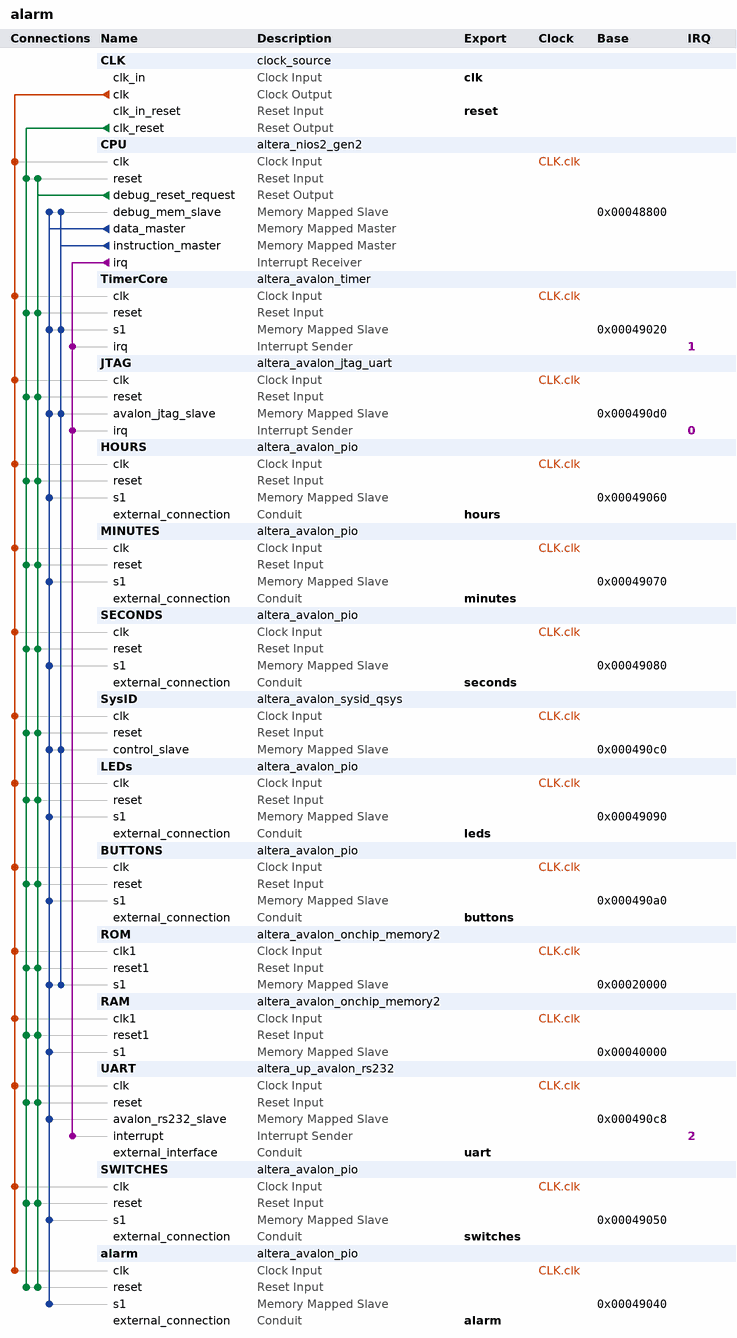
[diagram p0: system contents]
# Platform Designer (Qsys) system alarm, Cyclone V 5CSEMA5F31C6
# Parameters at their usual value, and those the tool derives, are not listed.
package require -exact qsys 18.1
create_system alarm
set_project_property DEVICE_FAMILY {Cyclone V}
set_project_property DEVICE 5CSEMA5F31C6

add_instance CLK clock_source 18.1
set_instance_parameter_value CLK clockFrequency 50000000

add_instance CPU altera_nios2_gen2 18.1
set_instance_parameter_value CPU dcache_size 2048
set_instance_parameter_value CPU exceptionSlave ROM.s1
set_instance_parameter_value CPU icache_size 4096
set_instance_parameter_value CPU impl Tiny
set_instance_parameter_value CPU resetSlave ROM.s1

add_instance TimerCore altera_avalon_timer 18.1
set_instance_parameter_value TimerCore fixedPeriod true
set_instance_parameter_value TimerCore period 1
set_instance_parameter_value TimerCore periodUnits SEC

add_instance JTAG altera_avalon_jtag_uart 18.1
set_instance_parameter_value JTAG simInteractiveOptions NO_INTERACTIVE_WINDOWS

add_instance HOURS altera_avalon_pio 18.1
set_instance_parameter_value HOURS direction Output
set_instance_parameter_value HOURS width 16

add_instance MINUTES altera_avalon_pio 18.1
set_instance_parameter_value MINUTES direction Output
set_instance_parameter_value MINUTES width 16

add_instance SECONDS altera_avalon_pio 18.1
set_instance_parameter_value SECONDS direction Output
set_instance_parameter_value SECONDS width 16

add_instance SysID altera_avalon_sysid_qsys 18.1
set_instance_parameter_value SysID id 0

add_instance LEDs altera_avalon_pio 18.1
set_instance_parameter_value LEDs direction Output
set_instance_parameter_value LEDs width 10

add_instance BUTTONS altera_avalon_pio 18.1
set_instance_parameter_value BUTTONS direction Input
set_instance_parameter_value BUTTONS width 4

add_instance ROM altera_avalon_onchip_memory2 18.1
set_instance_parameter_value ROM dataWidth 32
set_instance_parameter_value ROM dualPort false
set_instance_parameter_value ROM initMemContent true
set_instance_parameter_value ROM initializationFileName onchip_mem.hex
set_instance_parameter_value ROM memorySize 81920
set_instance_parameter_value ROM writable false

add_instance RAM altera_avalon_onchip_memory2 18.1
set_instance_parameter_value RAM dataWidth 32
set_instance_parameter_value RAM dualPort false
set_instance_parameter_value RAM initMemContent true
set_instance_parameter_value RAM initializationFileName onchip_mem.hex
set_instance_parameter_value RAM memorySize 32768

add_instance UART altera_up_avalon_rs232 17.1
set_instance_parameter_value UART baud 115200
set_instance_parameter_value UART parity None

add_instance SWITCHES altera_avalon_pio 18.1
set_instance_parameter_value SWITCHES direction Input
set_instance_parameter_value SWITCHES width 2

add_instance alarm altera_avalon_pio 18.1
set_instance_parameter_value alarm direction Output
set_instance_parameter_value alarm width 1

# connections
add_connection CLK.clk alarm.clk clock
add_connection CLK.clk BUTTONS.clk clock
add_connection CLK.clk CPU.clk clock
add_connection CLK.clk HOURS.clk clock
add_connection CLK.clk JTAG.clk clock
add_connection CLK.clk LEDs.clk clock
add_connection CLK.clk MINUTES.clk clock
add_connection CLK.clk RAM.clk1 clock
add_connection CLK.clk ROM.clk1 clock
add_connection CLK.clk SECONDS.clk clock
add_connection CLK.clk SWITCHES.clk clock
add_connection CLK.clk SysID.clk clock
add_connection CLK.clk TimerCore.clk clock
add_connection CLK.clk UART.clk clock
add_connection CLK.clk_reset alarm.reset reset
add_connection CLK.clk_reset BUTTONS.reset reset
add_connection CLK.clk_reset CPU.reset reset
add_connection CLK.clk_reset HOURS.reset reset
add_connection CLK.clk_reset JTAG.reset reset
add_connection CLK.clk_reset LEDs.reset reset
add_connection CLK.clk_reset MINUTES.reset reset
add_connection CLK.clk_reset RAM.reset1 reset
add_connection CLK.clk_reset ROM.reset1 reset
add_connection CLK.clk_reset SECONDS.reset reset
add_connection CLK.clk_reset SWITCHES.reset reset
add_connection CLK.clk_reset SysID.reset reset
add_connection CLK.clk_reset TimerCore.reset reset
add_connection CLK.clk_reset UART.reset reset
add_connection CPU.debug_reset_request alarm.reset reset
add_connection CPU.debug_reset_request BUTTONS.reset reset
add_connection CPU.debug_reset_request CPU.reset reset
add_connection CPU.debug_reset_request HOURS.reset reset
add_connection CPU.debug_reset_request JTAG.reset reset
add_connection CPU.debug_reset_request LEDs.reset reset
add_connection CPU.debug_reset_request MINUTES.reset reset
add_connection CPU.debug_reset_request RAM.reset1 reset
add_connection CPU.debug_reset_request ROM.reset1 reset
add_connection CPU.debug_reset_request SECONDS.reset reset
add_connection CPU.debug_reset_request SWITCHES.reset reset
add_connection CPU.debug_reset_request SysID.reset reset
add_connection CPU.debug_reset_request TimerCore.reset reset
add_connection CPU.debug_reset_request UART.reset reset
add_connection CPU.data_master alarm.s1 avalon
set_connection_parameter_value CPU.data_master/alarm.s1 baseAddress 0x00049040
add_connection CPU.data_master BUTTONS.s1 avalon
set_connection_parameter_value CPU.data_master/BUTTONS.s1 baseAddress 0x000490a0
add_connection CPU.data_master CPU.debug_mem_slave avalon
set_connection_parameter_value CPU.data_master/CPU.debug_mem_slave baseAddress 0x00048800
add_connection CPU.data_master HOURS.s1 avalon
set_connection_parameter_value CPU.data_master/HOURS.s1 baseAddress 0x00049060
add_connection CPU.data_master JTAG.avalon_jtag_slave avalon
set_connection_parameter_value CPU.data_master/JTAG.avalon_jtag_slave baseAddress 0x000490d0
add_connection CPU.data_master LEDs.s1 avalon
set_connection_parameter_value CPU.data_master/LEDs.s1 baseAddress 0x00049090
add_connection CPU.data_master MINUTES.s1 avalon
set_connection_parameter_value CPU.data_master/MINUTES.s1 baseAddress 0x00049070
add_connection CPU.data_master RAM.s1 avalon
set_connection_parameter_value CPU.data_master/RAM.s1 baseAddress 0x00040000
add_connection CPU.data_master ROM.s1 avalon
set_connection_parameter_value CPU.data_master/ROM.s1 baseAddress 0x00020000
add_connection CPU.data_master SECONDS.s1 avalon
set_connection_parameter_value CPU.data_master/SECONDS.s1 baseAddress 0x00049080
add_connection CPU.data_master SWITCHES.s1 avalon
set_connection_parameter_value CPU.data_master/SWITCHES.s1 baseAddress 0x00049050
add_connection CPU.data_master SysID.control_slave avalon
set_connection_parameter_value CPU.data_master/SysID.control_slave baseAddress 0x000490c0
add_connection CPU.data_master TimerCore.s1 avalon
set_connection_parameter_value CPU.data_master/TimerCore.s1 baseAddress 0x00049020
add_connection CPU.data_master UART.avalon_rs232_slave avalon
set_connection_parameter_value CPU.data_master/UART.avalon_rs232_slave baseAddress 0x000490c8
add_connection CPU.instruction_master CPU.debug_mem_slave avalon
set_connection_parameter_value CPU.instruction_master/CPU.debug_mem_slave baseAddress 0x00048800
add_connection CPU.instruction_master JTAG.avalon_jtag_slave avalon
set_connection_parameter_value CPU.instruction_master/JTAG.avalon_jtag_slave baseAddress 0x000490d0
add_connection CPU.instruction_master ROM.s1 avalon
set_connection_parameter_value CPU.instruction_master/ROM.s1 baseAddress 0x00020000
add_connection CPU.instruction_master SysID.control_slave avalon
set_connection_parameter_value CPU.instruction_master/SysID.control_slave baseAddress 0x000490c0
add_connection CPU.instruction_master TimerCore.s1 avalon
set_connection_parameter_value CPU.instruction_master/TimerCore.s1 baseAddress 0x00049020
add_connection CPU.irq JTAG.irq interrupt
set_connection_parameter_value CPU.irq/JTAG.irq irqNumber 0
add_connection CPU.irq TimerCore.irq interrupt
set_connection_parameter_value CPU.irq/TimerCore.irq irqNumber 1
add_connection CPU.irq UART.interrupt interrupt
set_connection_parameter_value CPU.irq/UART.interrupt irqNumber 2

# exported interfaces
add_interface alarm conduit end
set_interface_property alarm EXPORT_OF alarm.external_connection
add_interface buttons conduit end
set_interface_property buttons EXPORT_OF BUTTONS.external_connection
add_interface clk clock sink
set_interface_property clk EXPORT_OF CLK.clk_in
add_interface hours conduit end
set_interface_property hours EXPORT_OF HOURS.external_connection
add_interface leds conduit end
set_interface_property leds EXPORT_OF LEDs.external_connection
add_interface minutes conduit end
set_interface_property minutes EXPORT_OF MINUTES.external_connection
add_interface reset reset sink
set_interface_property reset EXPORT_OF CLK.clk_in_reset
add_interface seconds conduit end
set_interface_property seconds EXPORT_OF SECONDS.external_connection
add_interface switches conduit end
set_interface_property switches EXPORT_OF SWITCHES.external_connection
add_interface uart conduit end
set_interface_property uart EXPORT_OF UART.external_interface

set_interconnect_requirement {$system} qsys_mm.clockCrossingAdapter HANDSHAKE
set_interconnect_requirement {$system} qsys_mm.enableEccProtection FALSE
set_interconnect_requirement {$system} qsys_mm.insertDefaultSlave FALSE
set_interconnect_requirement {$system} qsys_mm.maxAdditionalLatency 1

save_system alarm.qsys
